# Altium schematic sheet zs-pentagon-dip_2.SchDoc
size A4
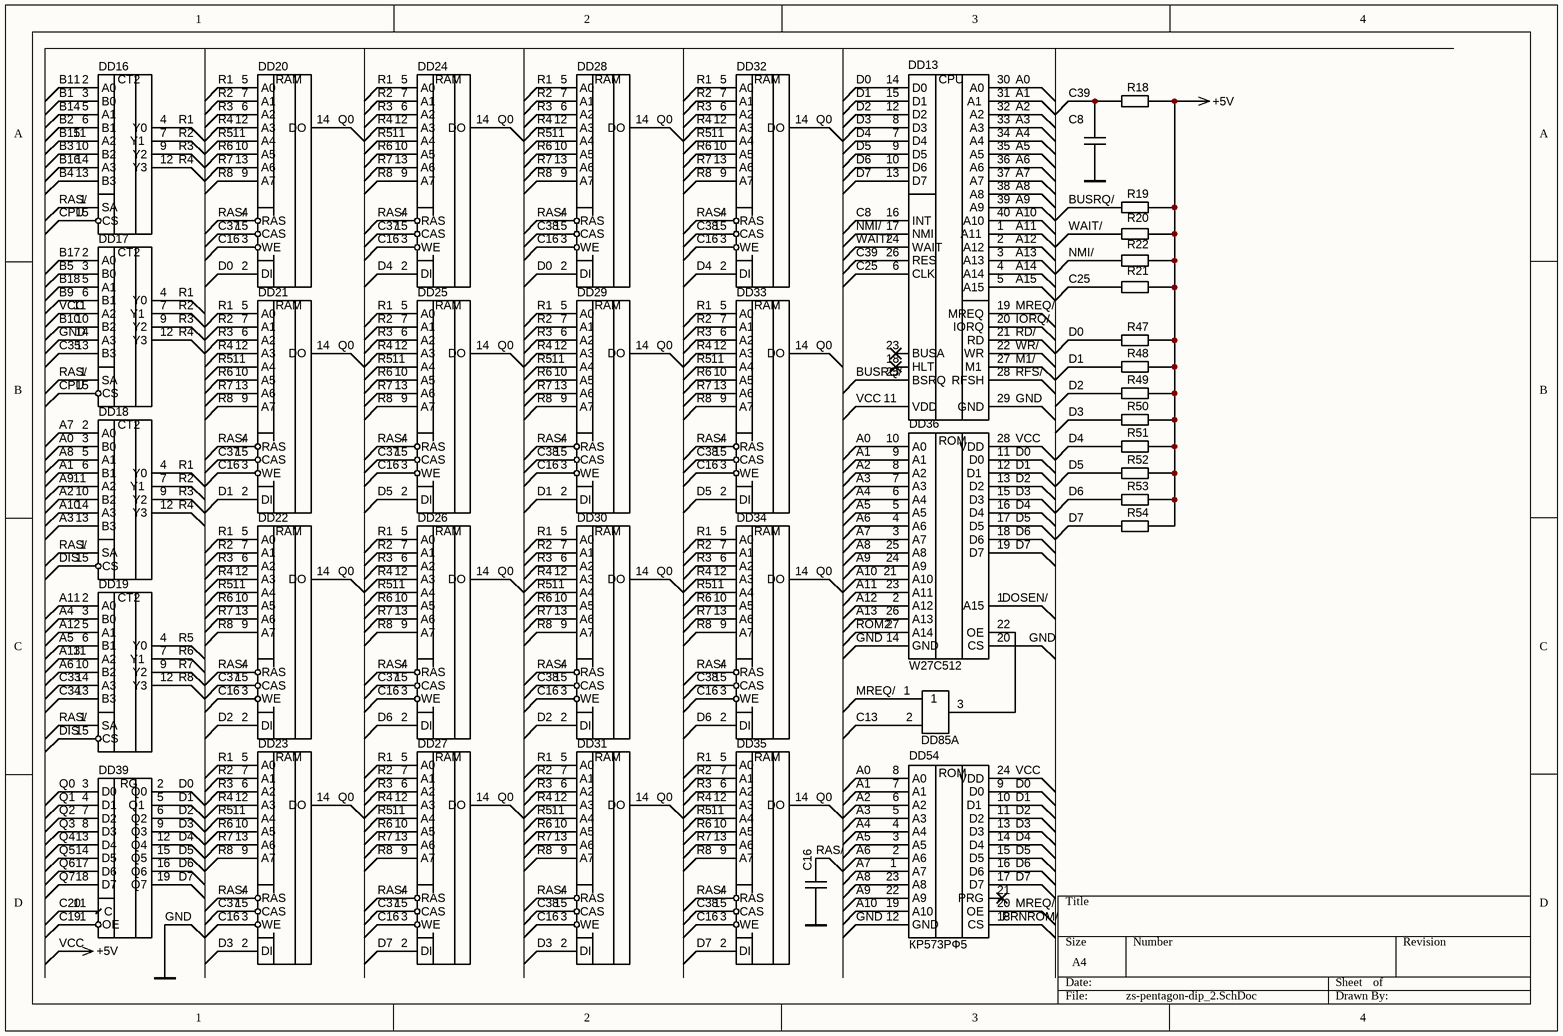
[diagram p0: zs-pentagon-dip_2.SchDoc]

## Parts
C8  10 мкФ  [C0805]  (value not drawn)
C16  51 пФ  [C0805]  (value not drawn)
DD13  Z80  [DIP1540W47P254L5320H635Q40B]  (value not drawn)
DD16  КР1533КП11А  [DIP16]  (value not drawn)
DD17  КР1533КП11А  [DIP16]  (value not drawn)
DD18  КР1533КП11А  [DIP16]  (value not drawn)
DD19  КР1533КП11А  [DIP16]  (value not drawn)
DD20  КР565РУ5Г  [DIP16]  (value not drawn)
DD21  КР565РУ5Г  [DIP16]  (value not drawn)
DD22  КР565РУ5Г  [DIP16]  (value not drawn)
DD23  КР565РУ5Г  [DIP16]  (value not drawn)
DD24  КР565РУ5Г  [DIP16]  (value not drawn)
DD25  КР565РУ5Г  [DIP16]  (value not drawn)
DD26  КР565РУ5Г  [DIP16]  (value not drawn)
DD27  КР565РУ5Г  [DIP16]  (value not drawn)
DD28  КР565РУ5Г  [DIP16]  (value not drawn)
DD29  КР565РУ5Г  [DIP16]  (value not drawn)
DD30  КР565РУ5Г  [DIP16]  (value not drawn)
DD31  КР565РУ5Г  [DIP16]  (value not drawn)
DD32  КР565РУ5Г  [DIP16]  (value not drawn)
DD33  КР565РУ5Г  [DIP16]  (value not drawn)
DD34  КР565РУ5Г  [DIP16]  (value not drawn)
DD35  КР565РУ5Г  [DIP16]  (value not drawn)
DD36  W27C512  [DIP28insocket]
DD39  КР1533ИР23  [DIP20]  (value not drawn)
DD54  КР573РФ5  [DIP24]
DD85  КР1533ЛЛ1  [DIP14]  (value not drawn)  (part A of 4)
R18  10 кОм  [R0603]  (value not drawn)  (no BOM)
R19  10 кОм  [R0603]  (value not drawn)  (no BOM)
R20  10 кОм  [R0603]  (value not drawn)  (no BOM)
R21  750 Ом  [R0603]  (value not drawn)  (no BOM)
R22  10 кОм  [R0603]  (value not drawn)  (no BOM)
R47  10 кОм  [R0603]  (value not drawn)  (no BOM)
R48  10 кОм  [R0603]  (value not drawn)  (no BOM)
R49  10 кОм  [R0603]  (value not drawn)  (no BOM)
R50  10 кОм  [R0603]  (value not drawn)  (no BOM)
R51  10 кОм  [R0603]  (value not drawn)  (no BOM)
R52  10 кОм  [R0603]  (value not drawn)  (no BOM)
R53  10 кОм  [R0603]  (value not drawn)  (no BOM)
R54  10 кОм  [R0603]  (value not drawn)  (no BOM)

## Nets
GND: C8.1 C16.1 DD13.29(GND) DD16.8(GND) DD17.8(GND) DD17.14(A3) DD18.8(GND) DD19.8(GND) DD36.14(GND) DD36.20(CS) DD39.10(GND) DD54.12(GND)
VCC: DD13.11(VDD) DD16.16(VCC) DD17.11(A2) DD17.16(VCC) DD18.16(VCC) DD19.16(VCC) DD36.28(VDD) DD39.20(VCC) DD54.24(VDD) R18.1 R19.1 R20.1 R21.1 R22.1 R47.1 R48.1 R49.1 R50.1 R51.1 R52.1 R53.1 R54.1  [also labelled +5V]
A0: DD13.30(A0) DD18.3(B0) DD36.10(A0) DD54.8(A0)
A1: DD13.31(A1) DD18.6(B1) DD36.9(A1) DD54.7(A1)
A2: DD13.32(A2) DD18.10(B2) DD36.8(A2) DD54.6(A2)
A3: DD13.33(A3) DD18.13(B3) DD36.7(A3) DD54.5(A3)
A4: DD13.34(A4) DD19.3(B0) DD36.6(A4) DD54.4(A4)
A5: DD13.35(A5) DD19.6(B1) DD36.5(A5) DD54.3(A5)
A6: DD13.36(A6) DD19.10(B2) DD36.4(A6) DD54.2(A6)
A7: DD13.37(A7) DD18.2(A0) DD36.3(A7) DD54.1(A7)
A8: DD13.38(A8) DD18.5(A1) DD36.25(A8) DD54.23(A8)
A9: DD13.39(A9) DD18.11(A2) DD36.24(A9) DD54.22(A9)
A10: DD13.40(A10) DD18.14(A3) DD36.21(A10) DD54.19(A10)
A11: DD13.1(A11) DD19.2(A0) DD36.23(A11)
A12: DD13.2(A12) DD19.5(A1) DD36.2(A12)
A13: DD13.3(A13) DD19.11(A2) DD36.26(A13)
A14: DD13.4(A14)
A15: DD13.5(A15)
B1: DD16.3(B0)
B2: DD16.6(B1)
B3: DD16.10(B2)
B4: DD16.13(B3)
B5: DD17.3(B0)
B9: DD17.6(B1)
B10: DD17.10(B2)
B11: DD16.2(A0)
B14: DD16.5(A1)
B15: DD16.11(A2)
B16: DD16.14(A3)
B17: DD17.2(A0)
B18: DD17.5(A1)
BUSRQ/: DD13.25(BSRQ) R19.2
C8: DD13.16(INT)
C13: DD85.2
C16: DD20.3(WE) DD21.3(WE) DD22.3(WE) DD23.3(WE) DD24.3(WE) DD25.3(WE) DD26.3(WE) DD27.3(WE) DD28.3(WE) DD29.3(WE) DD30.3(WE) DD31.3(WE) DD32.3(WE) DD33.3(WE) DD34.3(WE) DD35.3(WE)
C19: DD39.1(OE)
C20: DD39.11(C)
C25: DD13.6(CLK) R21.2
C33: DD19.14(A3)
C34: DD19.13(B3)
C35: DD17.13(B3)
C37: DD20.15(CAS) DD21.15(CAS) DD22.15(CAS) DD23.15(CAS) DD24.15(CAS) DD25.15(CAS) DD26.15(CAS) DD27.15(CAS)
C38: DD28.15(CAS) DD29.15(CAS) DD30.15(CAS) DD31.15(CAS) DD32.15(CAS) DD33.15(CAS) DD34.15(CAS) DD35.15(CAS)
C39: C8.2 DD13.26(RES) R18.2
CPU: DD16.15(CS) DD17.15(CS)
D0: DD13.14(D0) DD20.2(DI) DD28.2(DI) DD36.11(D0) DD39.2(Q0) DD54.9(D0) R47.2
D1: DD13.15(D1) DD21.2(DI) DD29.2(DI) DD36.12(D1) DD39.5(Q1) DD54.10(D1) R48.2
D2: DD13.12(D2) DD22.2(DI) DD30.2(DI) DD36.13(D2) DD39.6(Q2) DD54.11(D2) R49.2
D3: DD13.8(D3) DD23.2(DI) DD31.2(DI) DD36.15(D3) DD39.9(Q3) DD54.13(D3) R50.2
D4: DD13.7(D4) DD24.2(DI) DD32.2(DI) DD36.16(D4) DD39.12(Q4) DD54.14(D4) R51.2
D5: DD13.9(D5) DD25.2(DI) DD33.2(DI) DD36.17(D5) DD39.15(Q5) DD54.15(D5) R52.2
D6: DD13.10(D6) DD26.2(DI) DD34.2(DI) DD36.18(D6) DD39.16(Q6) DD54.16(D6) R53.2
D7: DD13.13(D7) DD27.2(DI) DD35.2(DI) DD36.19(D7) DD39.19(Q7) DD54.17(D7) R54.2
DIS: DD18.15(CS) DD19.15(CS)
DOSEN/: DD36.1(A15)
IORQ/: DD13.20(IORQ)
M1/: DD13.27(M1)
MREQ/: DD13.19(MREQ) DD54.20(OE) DD85.1
NMI/: DD13.17(NMI) R22.2
PRNROM/: DD54.18(CS)
Q0: DD20.14(DO) DD21.14(DO) DD22.14(DO) DD23.14(DO) DD24.14(DO) DD25.14(DO) DD26.14(DO) DD27.14(DO) DD28.14(DO) DD29.14(DO) DD30.14(DO) DD31.14(DO) DD32.14(DO) DD33.14(DO) DD34.14(DO) DD35.14(DO) DD39.3(D0)
Q1: DD39.4(D1)
Q2: DD39.7(D2)
Q3: DD39.8(D3)
Q4: DD39.13(D4)
Q5: DD39.14(D5)
Q6: DD39.17(D6)
Q7: DD39.18(D7)
R1: DD16.4(Y0) DD17.4(Y0) DD18.4(Y0) DD20.5(A0) DD21.5(A0) DD22.5(A0) DD23.5(A0) DD24.5(A0) DD25.5(A0) DD26.5(A0) DD27.5(A0) DD28.5(A0) DD29.5(A0) DD30.5(A0) DD31.5(A0) DD32.5(A0) DD33.5(A0) DD34.5(A0) DD35.5(A0)
R2: DD16.7(Y1) DD17.7(Y1) DD18.7(Y1) DD20.7(A1) DD21.7(A1) DD22.7(A1) DD23.7(A1) DD24.7(A1) DD25.7(A1) DD26.7(A1) DD27.7(A1) DD28.7(A1) DD29.7(A1) DD30.7(A1) DD31.7(A1) DD32.7(A1) DD33.7(A1) DD34.7(A1) DD35.7(A1)
R3: DD16.9(Y2) DD17.9(Y2) DD18.9(Y2) DD20.6(A2) DD21.6(A2) DD22.6(A2) DD23.6(A2) DD24.6(A2) DD25.6(A2) DD26.6(A2) DD27.6(A2) DD28.6(A2) DD29.6(A2) DD30.6(A2) DD31.6(A2) DD32.6(A2) DD33.6(A2) DD34.6(A2) DD35.6(A2)
R4: DD16.12(Y3) DD17.12(Y3) DD18.12(Y3) DD20.12(A3) DD21.12(A3) DD22.12(A3) DD23.12(A3) DD24.12(A3) DD25.12(A3) DD26.12(A3) DD27.12(A3) DD28.12(A3) DD29.12(A3) DD30.12(A3) DD31.12(A3) DD32.12(A3) DD33.12(A3) DD34.12(A3) DD35.12(A3)
R5: DD19.4(Y0) DD20.11(A4) DD21.11(A4) DD22.11(A4) DD23.11(A4) DD24.11(A4) DD25.11(A4) DD26.11(A4) DD27.11(A4) DD28.11(A4) DD29.11(A4) DD30.11(A4) DD31.11(A4) DD32.11(A4) DD33.11(A4) DD34.11(A4) DD35.11(A4)
R6: DD19.7(Y1) DD20.10(A5) DD21.10(A5) DD22.10(A5) DD23.10(A5) DD24.10(A5) DD25.10(A5) DD26.10(A5) DD27.10(A5) DD28.10(A5) DD29.10(A5) DD30.10(A5) DD31.10(A5) DD32.10(A5) DD33.10(A5) DD34.10(A5) DD35.10(A5)
R7: DD19.9(Y2) DD20.13(A6) DD21.13(A6) DD22.13(A6) DD23.13(A6) DD24.13(A6) DD25.13(A6) DD26.13(A6) DD27.13(A6) DD28.13(A6) DD29.13(A6) DD30.13(A6) DD31.13(A6) DD32.13(A6) DD33.13(A6) DD34.13(A6) DD35.13(A6)
R8: DD19.12(Y3) DD20.9(A7) DD21.9(A7) DD22.9(A7) DD23.9(A7) DD24.9(A7) DD25.9(A7) DD26.9(A7) DD27.9(A7) DD28.9(A7) DD29.9(A7) DD30.9(A7) DD31.9(A7) DD32.9(A7) DD33.9(A7) DD34.9(A7) DD35.9(A7)
RAS/: C16.2 DD16.1(SA) DD17.1(SA) DD18.1(SA) DD19.1(SA) DD20.4(RAS) DD21.4(RAS) DD22.4(RAS) DD23.4(RAS) DD24.4(RAS) DD25.4(RAS) DD26.4(RAS) DD27.4(RAS) DD28.4(RAS) DD29.4(RAS) DD30.4(RAS) DD31.4(RAS) DD32.4(RAS) DD33.4(RAS) DD34.4(RAS) DD35.4(RAS)
RD/: DD13.21(RD)
RFS/: DD13.28(RFSH)
ROM2: DD36.27(A14)
WAIT/: DD13.24(WAIT) R20.2
WR/: DD13.22(WR)
NetDD36_22: DD36.22(OE) DD85.3

Not connected (* = marked no-connect by the designer): DD13 18(HLT)* 23(BUSA)*; DD20 8(VCC) 16(GND); DD21 8(VCC) 16(GND); DD22 8(VCC) 16(GND); DD23 8(VCC) 16(GND); DD24 8(VCC) 16(GND); DD25 8(VCC) 16(GND); DD26 8(VCC) 16(GND); DD27 8(VCC) 16(GND); DD28 8(VCC) 16(GND); DD29 8(VCC) 16(GND); DD30 8(VCC) 16(GND); DD31 8(VCC) 16(GND); DD32 8(VCC) 16(GND); DD33 8(VCC) 16(GND); DD34 8(VCC) 16(GND); DD35 8(VCC) 16(GND); DD54 21(PRG)*; DD85 7(GND) 14(VCC)

## Notes on the sheet
- (in symbol W27C512) ROM
- (in symbol Z80) CPU
- (in symbol КР565РУ5Г) RAM
- (in symbol КР573РФ5) ROM
- (in symbol КР1533ИР23) RG
- (in symbol КР1533КП11А) CT2

## Library data of the parts
C8 C16 = CapCer
R18-R22 R47-R54 = Res